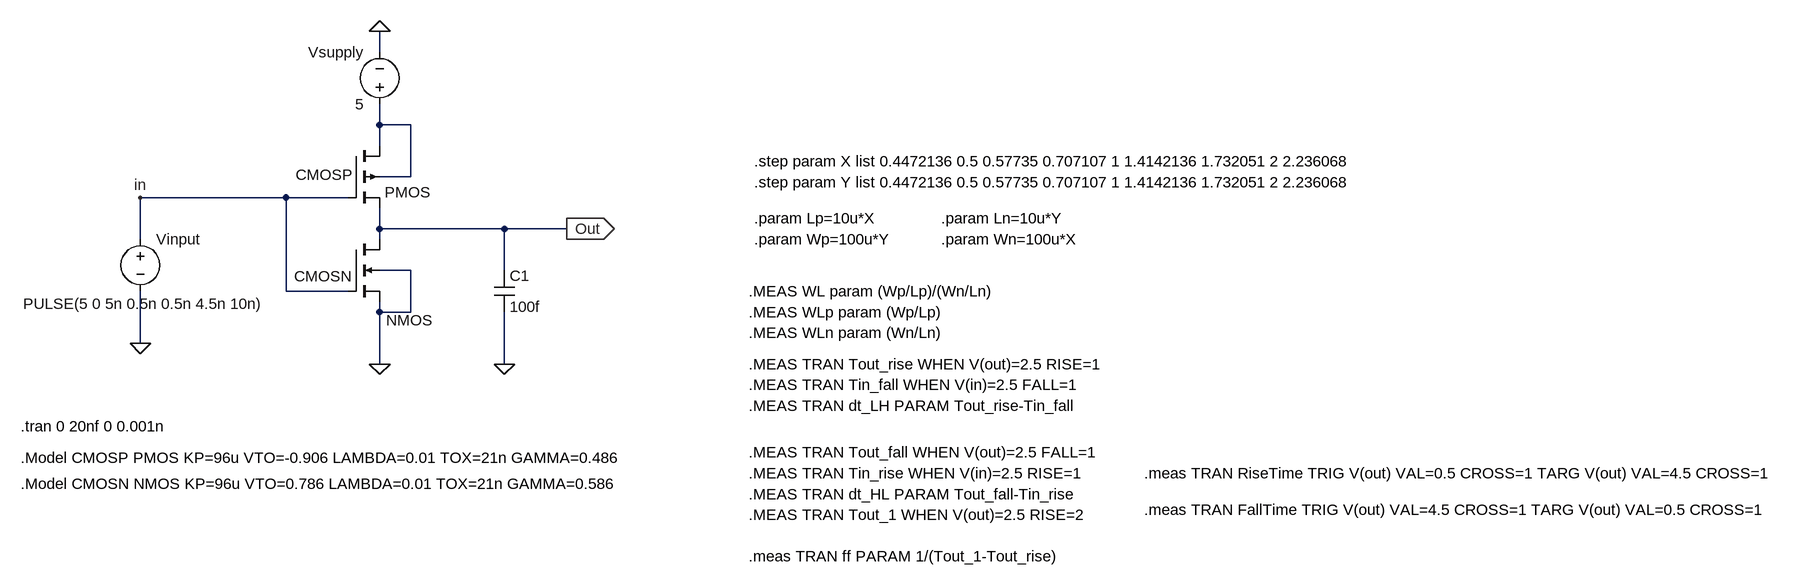
[diagram p0: schematic Inverter_paracitics_sweep.asc]
Inverter_paracitics_sweep.asc, the LTspice schematic file:
Version 4
SHEET 1 2564 752
WIRE 384 -80 384 -112
WIRE 384 32 384 0
WIRE 432 32 384 32
WIRE 384 64 384 32
WIRE 432 112 432 32
WIRE 432 112 384 112
WIRE 240 144 16 144
WIRE 336 144 240 144
WIRE 384 192 384 160
WIRE 576 192 384 192
WIRE 672 192 576 192
WIRE 16 208 16 144
WIRE 384 208 384 192
WIRE 432 256 384 256
WIRE 576 256 576 192
WIRE 240 288 240 144
WIRE 336 288 240 288
WIRE 384 320 384 304
WIRE 432 320 432 256
WIRE 432 320 384 320
WIRE 16 368 16 288
WIRE 384 400 384 320
WIRE 576 400 576 320
FLAG 384 400 0
FLAG 384 -112 0
FLAG 16 368 0
FLAG 672 192 Out
IOPIN 672 192 Out
FLAG 576 400 0
FLAG 16 144 in
SYMBOL pmos4 336 64 R0
WINDOW 0 -81 45 Left 2
SYMATTR InstName CMOSP
SYMATTR Value2 l={Lp} w={Wp}
SYMBOL nmos4 336 208 R0
WINDOW 0 -83 57 Left 2
WINDOW 3 58 125 Left 2
SYMATTR InstName CMOSN
SYMATTR Value2 l={Ln} w={Wn}
SYMBOL voltage 384 16 R180
WINDOW 0 24 96 Left 2
WINDOW 3 24 16 Left 2
WINDOW 123 0 0 Left 0
WINDOW 39 0 0 Left 0
SYMATTR InstName Vsupply
SYMATTR Value 5
SYMBOL voltage 16 192 R0
WINDOW 3 -180 115 Left 2
WINDOW 123 0 0 Left 0
WINDOW 39 0 0 Left 0
SYMATTR Value PULSE(5 0 5n 0.5n 0.5n 4.5n 10n)
SYMATTR InstName Vinput
SYMBOL cap 560 256 R0
SYMATTR InstName C1
SYMATTR Value 100f
TEXT -168 496 Left 2 !.tran 0 20nf 0 0.001n
TEXT -168 584 Left 2 !.Model CMOSN NMOS KP=96u VTO=0.786 LAMBDA=0.01 TOX=21n GAMMA=0.586
TEXT -168 544 Left 2 !.Model CMOSP PMOS KP=96u VTO=-0.906 LAMBDA=0.01 TOX=21n GAMMA=0.486
TEXT 952 400 Left 2 !.MEAS TRAN Tout_rise WHEN V(out)=2.5 RISE=1
TEXT 952 432 Left 2 !.MEAS TRAN Tin_fall WHEN V(in)=2.5 FALL=1
TEXT 952 464 Left 2 !.MEAS TRAN dt_LH PARAM Tout_rise-Tin_fall
TEXT 952 536 Left 2 !.MEAS TRAN Tout_fall WHEN V(out)=2.5 FALL=1
TEXT 952 568 Left 2 !.MEAS TRAN Tin_rise WHEN V(in)=2.5 RISE=1
TEXT 952 600 Left 2 !.MEAS TRAN dt_HL PARAM Tout_fall-Tin_rise
TEXT 960 88 Left 2 !.step param X list 0.4472136 0.5 0.57735 0.707107 1 1.4142136 1.732051 2 2.236068
TEXT 960 120 Left 2 !.step param Y list 0.4472136 0.5 0.57735 0.707107 1 1.4142136 1.732051 2 2.236068
TEXT 952 288 Left 2 !.MEAS WL param (Wp/Lp)/(Wn/Ln)
TEXT 960 176 Left 2 !.param Lp=10u*X
TEXT 960 208 Left 2 !.param Wp=100u*Y
TEXT 1248 176 Left 2 !.param Ln=10u*Y
TEXT 1248 208 Left 2 !.param Wn=100u*X
TEXT 952 320 Left 2 !.MEAS WLp param (Wp/Lp)
TEXT 952 352 Left 2 !.MEAS WLn param (Wn/Ln)
TEXT 952 632 Left 2 !.MEAS TRAN Tout_1 WHEN V(out)=2.5 RISE=2
TEXT 952 696 Left 2 !.meas TRAN ff PARAM 1/(Tout_1-Tout_rise)
TEXT 1560 568 Left 2 !.meas TRAN RiseTime TRIG V(out) VAL=0.5 CROSS=1 TARG V(out) VAL=4.5 CROSS=1
TEXT 1560 624 Left 2 !.meas TRAN FallTime TRIG V(out) VAL=4.5 CROSS=1 TARG V(out) VAL=0.5 CROSS=1

The netlist it stands for:
* Inverter_paracitics_sweep.asc
M§CMOSP N001 in Out N001 PMOS l={Lp} w={Wp}
M§CMOSN Out in 0 0 NMOS l={Ln} w={Wn}
Vsupply N001 0 5
Vinput in 0 PULSE(5 0 5n 0.5n 0.5n 4.5n 10n)
C1 Out 0 100f
.model NMOS NMOS
.model PMOS PMOS
.lib standard.mos
.tran 0 20nf 0 0.001n
.Model CMOSN NMOS KP=96u VTO=0.786 LAMBDA=0.01 TOX=21n GAMMA=0.586
.Model CMOSP PMOS KP=96u VTO=-0.906 LAMBDA=0.01 TOX=21n GAMMA=0.486
.MEAS TRAN Tout_rise WHEN V(out)=2.5 RISE=1
.MEAS TRAN Tin_fall WHEN V(in)=2.5 FALL=1
.MEAS TRAN dt_LH PARAM Tout_rise-Tin_fall
.MEAS TRAN Tout_fall WHEN V(out)=2.5 FALL=1
.MEAS TRAN Tin_rise WHEN V(in)=2.5 RISE=1
.MEAS TRAN dt_HL PARAM Tout_fall-Tin_rise
.step param X list 0.4472136 0.5 0.57735 0.707107 1 1.4142136 1.732051 2 2.236068
.step param Y list 0.4472136 0.5 0.57735 0.707107 1 1.4142136 1.732051 2 2.236068
.MEAS WL param (Wp/Lp)/(Wn/Ln)
.param Lp=10u*X
.param Wp=100u*Y
.param Ln=10u*Y
.param Wn=100u*X
.MEAS WLp param (Wp/Lp)
.MEAS WLn param (Wn/Ln)
.MEAS TRAN Tout_1 WHEN V(out)=2.5 RISE=2
.meas TRAN ff PARAM 1/(Tout_1-Tout_rise)
.meas TRAN RiseTime TRIG V(out) VAL=0.5 CROSS=1 TARG V(out) VAL=4.5 CROSS=1
.meas TRAN FallTime TRIG V(out) VAL=4.5 CROSS=1 TARG V(out) VAL=0.5 CROSS=1
.backanno
.end

* Results of the author's LTspice run, read from the files saved beside the schematic
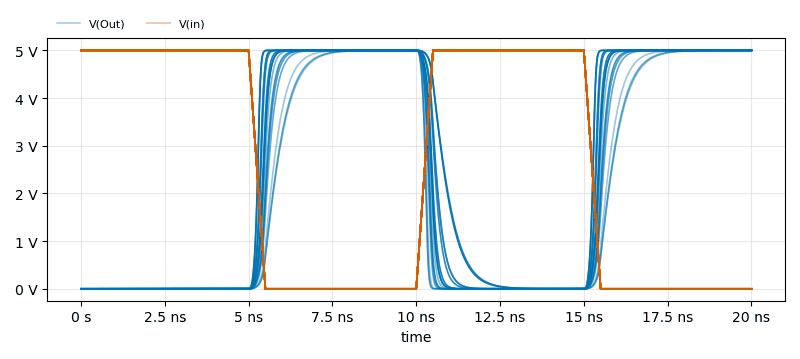
[diagram p1: Transient Analysis of Inverter_paracitics_sweep.asc, plotted from the saved traces]
* Transient Analysis, 81 runs:
*   V(Out) [run 1]: min 0 V, max 5 V, average 2.386 V, rms 3.409 V, last 5 V
*   V(Out) [run 2]: min 0 V, max 5 V, average 2.164 V, rms 3.203 V, last 5 V
*   V(Out) [run 3]: min 0 V, max 5 V, average 2.386 V, rms 3.409 V, last 5 V
*   V(Out) [run 4]: min 0 V, max 5 V, average 2.094 V, rms 3.129 V, last 5 V
*   V(Out) [run 5]: min 0 V, max 5 V, average 2.355 V, rms 3.384 V, last 5 V
*   V(Out) [run 6]: min 0 V, max 5 V, average 2.104 V, rms 3.14 V, last 5 V
*   V(Out) [run 7]: min 0 V, max 5 V, average 2.269 V, rms 3.307 V, last 5 V
*   V(Out) [run 8]: min 0 V, max 5 V, average 2.486 V, rms 3.481 V, last 5 V
*   V(in) [run 1]: min 0 V, max 5 V, average 2.562 V, rms 3.535 V, last 0 V
*   V(in) [run 2]: min 0 V, max 5 V, average 2.562 V, rms 3.535 V, last 0 V
*   V(in) [run 3]: min 0 V, max 5 V, average 2.562 V, rms 3.535 V, last 0 V
*   V(in) [run 4]: min 0 V, max 5 V, average 2.562 V, rms 3.535 V, last 0 V
*   V(in) [run 5]: min 0 V, max 5 V, average 2.562 V, rms 3.535 V, last 0 V
*   V(in) [run 6]: min 0 V, max 5 V, average 2.562 V, rms 3.535 V, last 0 V
*   V(in) [run 7]: min 0 V, max 5 V, average 2.562 V, rms 3.535 V, last 0 V
*   V(in) [run 8]: min 0 V, max 5 V, average 2.562 V, rms 3.535 V, last 0 V
* From the log:
*   Measurement: tout_rise
*     step  v(out)=2.5
*        1  5.45137e-09
*        2  5.47003e-09
*        3  5.49507e-09
*        4  5.53408e-09
*        5  5.61921e-09
*        6  5.73423e-09
*        7  5.81928e-09
*        8  5.89074e-09
*        9  5.95344e-09
*       10  5.43333e-09
*       11  5.45137e-09
*       12  5.47554e-09
*       13  5.51221e-09
*       14  5.58857e-09
*       15  5.69287e-09
*       16  5.77073e-09
*       17  5.83425e-09
*       18  5.89074e-09
*       19  5.41099e-09
*       20  5.42823e-09
*       21  5.45137e-09
*       22  5.48576e-09
*       23  5.55439e-09
*       24  5.64585e-09
*       25  5.71429e-09
*       26  5.77073e-09
*       27  5.81928e-09
*       28  5.38131e-09
*       29  5.39738e-09
*       30  5.41905e-09
*       31  5.45137e-09
*       32  5.51221e-09
*       33  5.58857e-09
*       34  5.64585e-09
*       35  5.69287e-09
*       36  5.73423e-09
*       37  5.33551e-09
*       38  5.34957e-09
*       39  5.36865e-09
*       40  5.39738e-09
*     ...
*   Measurement: tin_fall
*     step  v(in)=2.5
*        1  5.25e-09
*        2  5.25e-09
*        3  5.25e-09
*        4  5.25e-09
*        5  5.25e-09
*        6  5.25e-09
*        7  5.25e-09
*        8  5.25e-09
*        9  5.25e-09
*       10  5.25e-09
*       11  5.25e-09
*       12  5.25e-09
*       13  5.25e-09
*       14  5.25e-09
*       15  5.25e-09
*       16  5.25e-09
*       17  5.25e-09
*       18  5.25e-09
*       19  5.25e-09
*       20  5.25e-09
*       21  5.25e-09
*       22  5.25e-09
*       23  5.25e-09
*       24  5.25e-09
*       25  5.25e-09
*       26  5.25e-09
*       27  5.25e-09
*       28  5.25e-09
*       29  5.25e-09
*       30  5.25e-09
*       31  5.25e-09
*       32  5.25e-09
*       33  5.25e-09
*       34  5.25e-09
*       35  5.25e-09
*       36  5.25e-09
*       37  5.25e-09
*       38  5.25e-09
*       39  5.25e-09
*       40  5.25e-09
*     ...
*   Measurement: dt_lh
*     step  tout_rise-tin_fall
*        1  2.01366e-10
*        2  2.20027e-10
*        3  2.45066e-10
*        4  2.84078e-10
*        5  3.69211e-10
*        6  4.84226e-10
*        7  5.69283e-10
*        8  6.40739e-10
*        9  7.03439e-10
*       10  1.83329e-10
*       11  2.01366e-10
*       12  2.25545e-10
*       13  2.62206e-10
*       14  3.38574e-10
*       15  4.42869e-10
*       16  5.2073e-10
*       17  5.84253e-10
*       18  6.40739e-10
*       19  1.60993e-10
*       20  1.78228e-10
*       21  2.01366e-10
*       22  2.3576e-10
*       23  3.04386e-10
*       24  3.95853e-10
*       25  4.64292e-10
*       26  5.2073e-10
*       27  5.69283e-10
*       28  1.31313e-10
*       29  1.47381e-10
*       30  1.69054e-10
*       31  2.01366e-10
*       32  2.62206e-10
*       33  3.38574e-10
*       34  3.95853e-10
*       35  4.42869e-10
*       36  4.84225e-10
*       37  8.55084e-11
*       38  9.95702e-11
*       39  1.18653e-10
*       40  1.47381e-10
*     ...
*   Measurement: tout_fall
*     step  v(out)=2.5
*        1  1.04514e-08
*        2  1.04333e-08
*        3  1.0411e-08
*        4  1.03813e-08
*        5  1.03355e-08
*        6  1.02957e-08
*        7  1.0275e-08
*        8  1.02613e-08
*        9  1.02512e-08
*       10  1.047e-08
*       11  1.04514e-08
*       12  1.04282e-08
*       13  1.03974e-08
*       14  1.03496e-08
*       15  1.03079e-08
*       16  1.02862e-08
*       17  1.02719e-08
*       18  1.02613e-08
*       19  1.04951e-08
*       20  1.04755e-08
*       21  1.04514e-08
*       22  1.04191e-08
*       23  1.03687e-08
*       24  1.03245e-08
*       25  1.03014e-08
*       26  1.02862e-08
*       27  1.0275e-08
*       28  1.05342e-08
*       29  1.05122e-08
*       30  1.04858e-08
*       31  1.04514e-08
*       32  1.03974e-08
*       33  1.03496e-08
*       34  1.03245e-08
*       35  1.03079e-08
*       36  1.02957e-08
*       37  1.06189e-08
*       38  1.05889e-08
*       39  1.05543e-08
*       40  1.05122e-08
*     ...
*   Measurement: tin_rise
*     step  v(in)=2.5
*        1  1.025e-08
*        2  1.025e-08
*        3  1.025e-08
*        4  1.025e-08
*        5  1.025e-08
*        6  1.025e-08
*        7  1.025e-08
*        8  1.025e-08
*        9  1.025e-08
*       10  1.025e-08
*       11  1.025e-08
*       12  1.025e-08
*       13  1.025e-08
*       14  1.025e-08
*       15  1.025e-08
*       16  1.025e-08
*       17  1.025e-08
*       18  1.025e-08
*       19  1.025e-08
*       20  1.025e-08
*       21  1.025e-08
*       22  1.025e-08
*       23  1.025e-08
*       24  1.025e-08
*       25  1.025e-08
*       26  1.025e-08
*       27  1.025e-08
*       28  1.025e-08
*       29  1.025e-08
*       30  1.025e-08
*       31  1.025e-08
*       32  1.025e-08
*       33  1.025e-08
*       34  1.025e-08
*       35  1.025e-08
*       36  1.025e-08
*       37  1.025e-08
*       38  1.025e-08
*       39  1.025e-08
*       40  1.025e-08
*     ...
*   Measurement: dt_hl
*     step  tout_fall-tin_rise
*        1  2.01366e-10
*        2  1.83329e-10
*        3  1.60994e-10
*        4  1.31313e-10
*        5  8.55084e-11
*        6  4.57431e-11
*        7  2.50002e-11
*        8  1.13123e-11
*        9  1.19725e-12
*       10  2.20027e-10
*       11  2.01366e-10
*       12  1.78228e-10
*       13  1.47381e-10
*       14  9.95702e-11
*       15  5.79317e-11
*       16  3.61975e-11
*       17  2.1871e-11
*       18  1.13123e-11
*       19  2.45066e-10
*       20  2.25545e-10
*       21  2.01366e-10
*       22  1.69054e-10
*       23  1.1865e-10
*       24  7.44825e-11
*       25  5.14262e-11
*       26  3.61975e-11
*       27  2.50001e-11
*       28  2.84179e-10
*       29  2.62183e-10
*       30  2.3576e-10
*       31  2.01366e-10
*       32  1.47381e-10
*       33  9.95702e-11
*       34  7.44826e-11
*       35  5.79318e-11
*       36  4.57431e-11
*       37  3.6887e-10
*       38  3.38931e-10
*       39  3.04263e-10
*       40  2.62183e-10
*     ...
*   Measurement: wl
*     step  (wp/lp)/(wn/ln)
*        1  1
*        2  0.8
*        3  0.600001
*        4  0.4
*        5  0.2
*        6  0.1
*        7  0.0666667
*        8  0.05
*        9  0.04
*       10  1.25
*       11  1
*       12  0.750001
*       13  0.5
*       14  0.25
*       15  0.125
*       16  0.0833333
*       17  0.0625
*       18  0.05
*       19  1.66667
*       20  1.33333
*       21  1
*       22  0.666666
*       23  0.333333
*       24  0.166667
*       25  0.111111
*       26  0.0833333
*       27  0.0666666
*       28  2.5
*       29  2
*       30  1.5
*       31  1
*       32  0.5
*       33  0.25
*       34  0.166667
*       35  0.125
*       36  0.1
*       37  5
*       38  4
*       39  3
*       40  2
*     ...
*   Measurement: wlp
*     step  (wp/lp)
*        1  10
*        2  8.94427
*        3  7.74597
*        4  6.32455
*        5  4.47214
*        6  3.16228
*        7  2.58199
*        8  2.23607
*        9  2
*       10  11.1803
*       11  10
*       12  8.66026
*       13  7.07107
*       14  5
*       15  3.53553
*       16  2.88675
*       17  2.5
*       18  2.23607
*       19  12.9099
*       20  11.547
*       21  10
*       22  8.16496
*       23  5.7735
*       24  4.08248
*       25  3.33333
*       26  2.88675
*       27  2.58199
*       28  15.8114
*       29  14.1421
*       30  12.2475
*       31  10
*       32  7.07107
*       33  5
*       34  4.08248
*       35  3.53554
*       36  3.16228
*       37  22.3607
*       38  20
*       39  17.3205
*       40  14.1421
*     ...
*   Measurement: wln
*     step  (wn/ln)
*        1  10
*        2  11.1803
*        3  12.9099
*        4  15.8114
*        5  22.3607
*        6  31.6228
*        7  38.7298
*        8  44.7214
*        9  50
*       10  8.94427
*       11  10
*       12  11.547
*       13  14.1421
*       14  20
*       15  28.2843
*       16  34.641
*       17  40
*       18  44.7214
*       19  7.74597
*       20  8.66026
*       21  10
*       22  12.2475
*       23  17.3205
*       24  24.4949
*       25  30
*       26  34.641
*       27  38.7299
*       28  6.32455
*       29  7.07107
*       30  8.16496
*       31  10
*       32  14.1421
*       33  20
*       34  24.4949
*       35  28.2843
*       36  31.6228
*       37  4.47214
*       38  5
*       39  5.7735
*       40  7.07107
*     ...
*   Measurement: tout_1
*     step  v(out)=2.5
*        1  1.54514e-08
*        2  1.547e-08
*        3  1.54951e-08
*        4  1.55341e-08
*        5  1.56192e-08
*        6  1.57342e-08
*        7  1.58193e-08
*        8  1.58907e-08
*        9  1.59534e-08
*       10  1.54333e-08
*       11  1.54514e-08